# EAGLE board ALU (EAGLE 9.4.2)
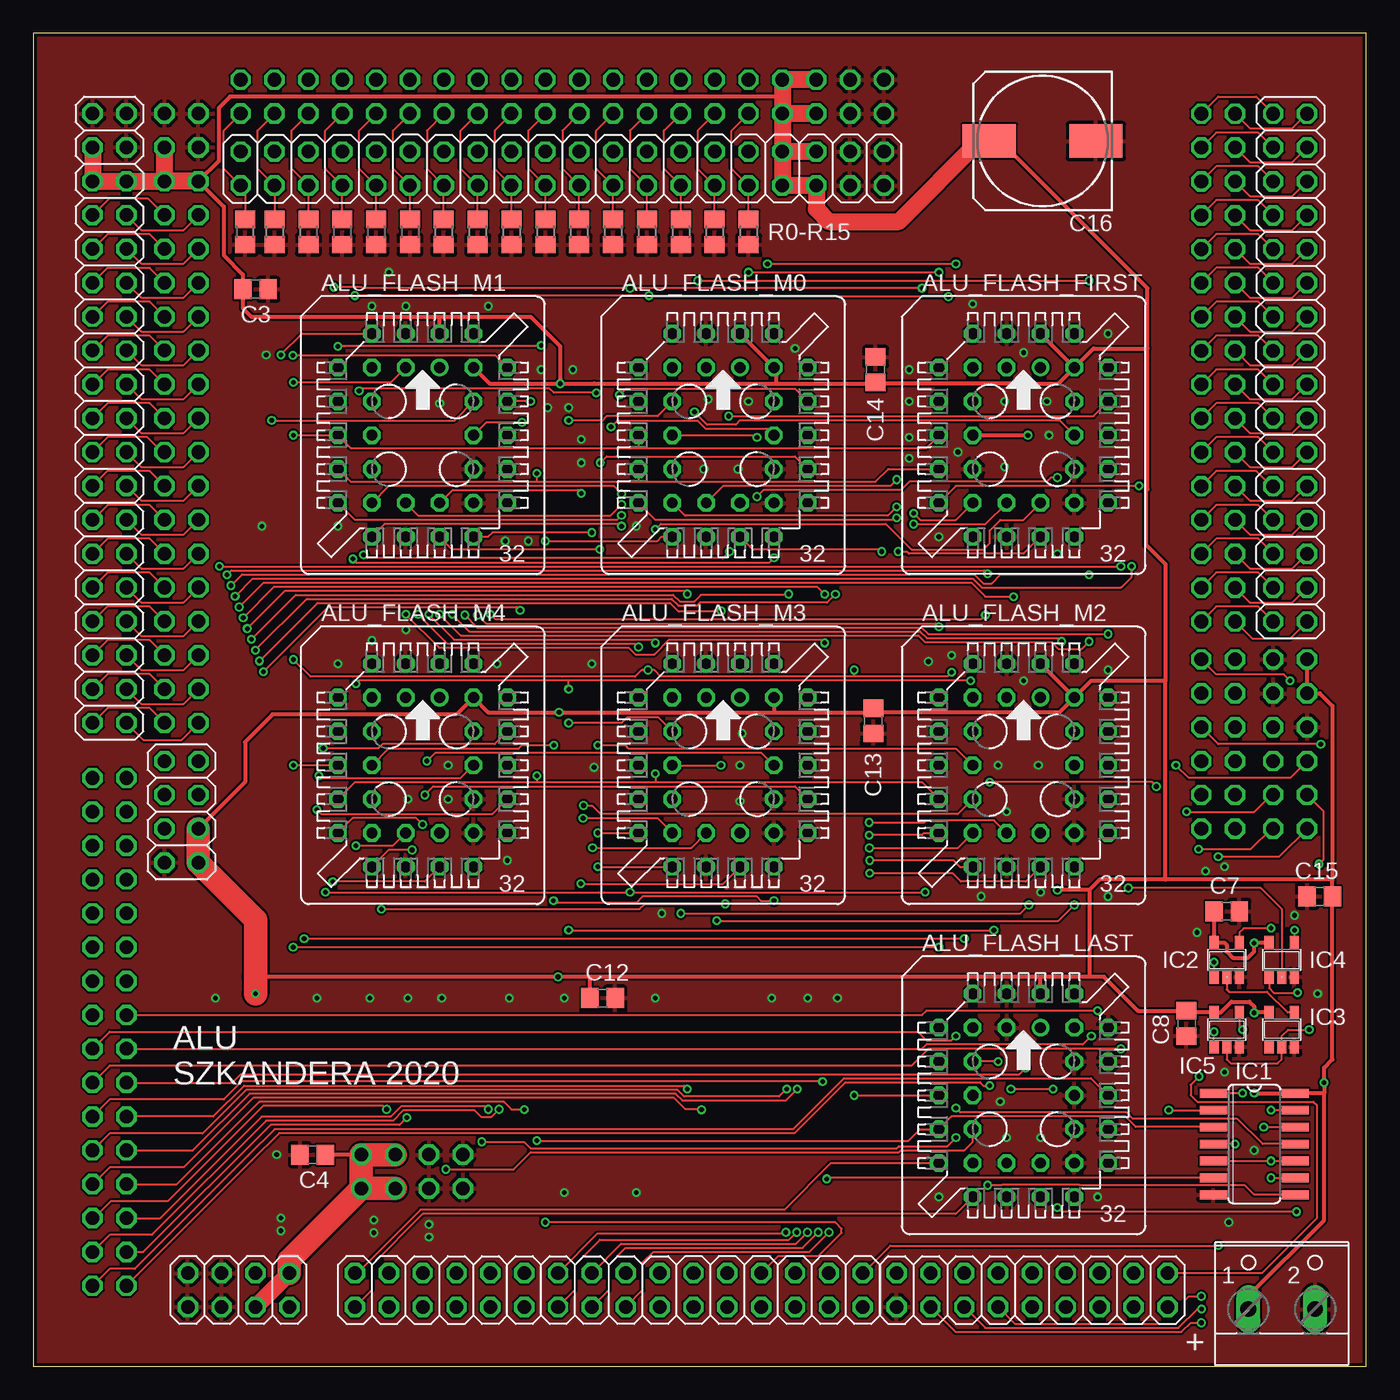
[diagram p2: board, top side]
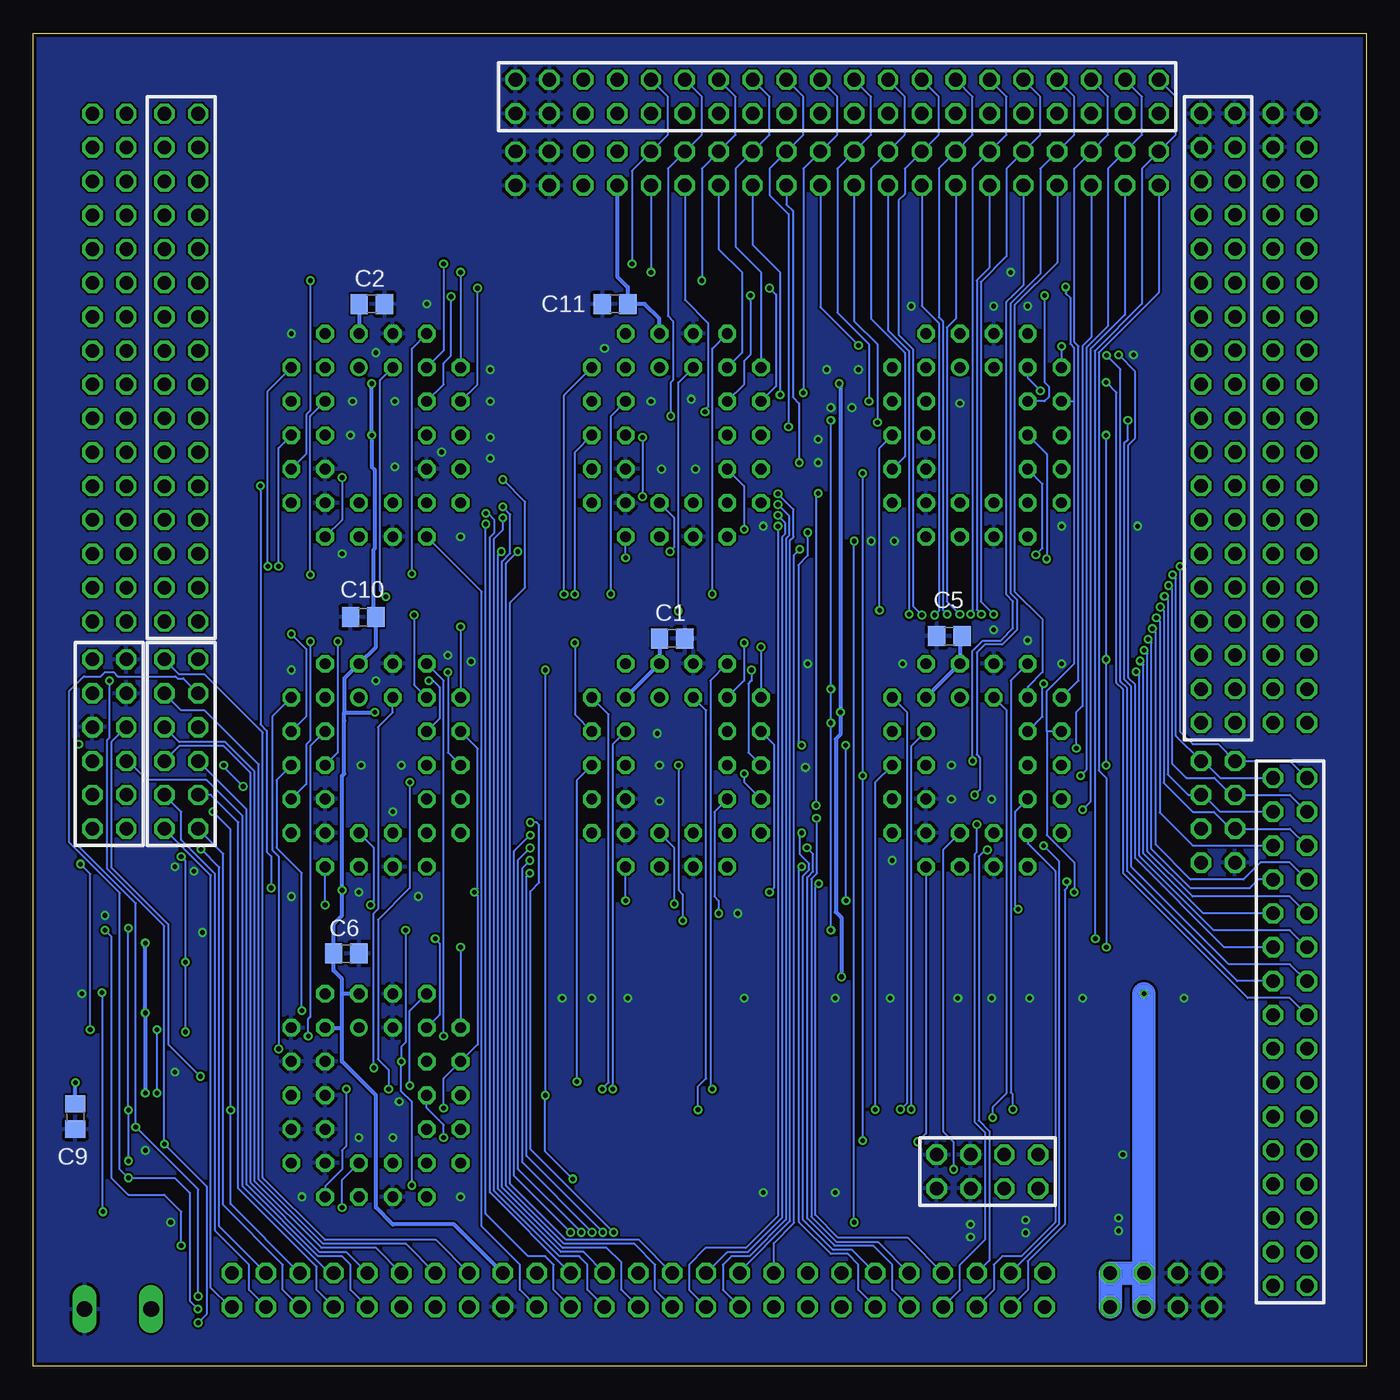
[diagram p3: board, bottom side, seen from below]

Size 100 x 100 mm. Coordinates in mm from the lower left corner, seen from the top.
Outline: 0,0 100,0 100,100 0,100 0,0
Copper layers (1*16): Top 0.035mm / dielectric 1.5mm / Bottom 0.035mm
Design rules "SeeedStudio_2layer_DRU_no_angle_20140221": minimum track width 6mil, minimum drill 12mil, track to track 6mil, track to pad 6mil, pad to pad 6mil, via to via 6mil, smd to smd 0mil, copper to edge 10mil, drill to drill 10mil, minimum pad ring 10mil, minimum via ring 6mil, stop-mask expansion 2mil, vias tented up to drill 100mil, thermal gap 10mil

## Footprints (pad centres in the part's own frame; a part is rotated, then mirrored left to right if it is on the bottom)
S32 = drill 0.813: 1 1.27,5.08 | drill 0.813 octagon: 2 -1.27,7.62; 3 -1.27,5.08; 4 -3.81,7.62; 5 -6.35,5.08; 6 -3.81,5.08; 7 -6.35,2.54; 8 -3.81,2.54; 9 -6.35,0; 10 -3.81,0; 11 -6.35,-2.54; 12 -3.81,-2.54; 13 -6.35,-5.08; 14 -3.81,-7.62; 15 -3.81,-5.08; 16 -1.27,-7.62; 17 -1.27,-5.08; 18 1.27,-7.62; 19 1.27,-5.08; 20 3.81,-7.62; 21 6.35,-5.08; 22 3.81,-5.08; 23 6.35,-2.54; 24 3.81,-2.54; 25 6.35,0; 26 3.81,0; 27 6.35,2.54; 28 3.81,2.54; 29 6.35,5.08; 30 3.81,7.62; 31 3.81,5.08; 32 1.27,7.62
2X16 = drill 1.016 octagon: 1 -19.05,-1.27; 2 -19.05,1.27; 3 -16.51,-1.27; 4 -16.51,1.27; 5 -13.97,-1.27; 6 -13.97,1.27; 7 -11.43,-1.27; 8 -11.43,1.27; 9 -8.89,-1.27; 10 -8.89,1.27; 11 -6.35,-1.27; 12 -6.35,1.27; 13 -3.81,-1.27; 14 -3.81,1.27; 15 -1.27,-1.27; 16 -1.27,1.27; 17 1.27,-1.27; 18 1.27,1.27; 19 3.81,-1.27; 20 3.81,1.27; 21 6.35,-1.27; 22 6.35,1.27; 23 8.89,-1.27; 24 8.89,1.27; 25 11.43,-1.27; 26 11.43,1.27; 27 13.97,-1.27; 28 13.97,1.27; 29 16.51,-1.27; 30 16.51,1.27; 31 19.05,-1.27; 32 19.05,1.27
2X04 = drill 1.016 octagon: 1 -3.81,-1.27; 2 -3.81,1.27; 3 -1.27,-1.27; 4 -1.27,1.27; 5 1.27,-1.27; 6 1.27,1.27; 7 3.81,-1.27; 8 3.81,1.27
C0805 = smd 1.3 x 1.5: 1 -0.95,0; 2 0.95,0
153CLV-1010 = smd 4 x 2.5: + 4,0; - -4,0
SO14 = smd 0.66 x 2.032: 1 -3.81,-3.073; 2 -2.54,-3.073; 3 -1.27,-3.073; 4 0,-3.073; 5 1.27,-3.073; 6 2.54,-3.073; 7 3.81,-3.073; 8 3.81,3.073; 9 2.54,3.073; 10 1.27,3.073; 11 0,3.073; 12 -1.27,3.073; 13 -2.54,3.073; 14 -3.81,3.073
SOT23-5 = smd 0.69 x 0.99: 1 -0.95,-1.29; 2 0,-1.29; 3 0.95,-1.29; 4 0.95,1.3; 5 -0.95,1.3
2X09 = drill 1.016 octagon: 1 -10.16,-1.27; 2 -10.16,1.27; 3 -7.62,-1.27; 4 -7.62,1.27; 5 -5.08,-1.27; 6 -5.08,1.27; 7 -2.54,-1.27; 8 -2.54,1.27; 9 0,-1.27; 10 0,1.27; 11 2.54,-1.27; 12 2.54,1.27; 13 5.08,-1.27; 14 5.08,1.27; 15 7.62,-1.27; 16 7.62,1.27; 17 10.16,-1.27; 18 10.16,1.27
2X06 = drill 1.016 octagon: 1 -6.35,-1.27; 2 -6.35,1.27; 3 -3.81,-1.27; 4 -3.81,1.27; 5 -1.27,-1.27; 6 -1.27,1.27; 7 1.27,-1.27; 8 1.27,1.27; 9 3.81,-1.27; 10 3.81,1.27; 11 6.35,-1.27; 12 6.35,1.27
R0805 = smd 1.3 x 1.5: 1 -0.95,0; 2 0.95,0
2X20 = drill 1.016 octagon: 1 -24.13,-1.27; 2 -24.13,1.27; 3 -21.59,-1.27; 4 -21.59,1.27; 5 -19.05,-1.27; 6 -19.05,1.27; 7 -16.51,-1.27; 8 -16.51,1.27; 9 -13.97,-1.27; 10 -13.97,1.27; 11 -11.43,-1.27; 12 -11.43,1.27; 13 -8.89,-1.27; 14 -8.89,1.27; 15 -6.35,-1.27; 16 -6.35,1.27; 17 -3.81,-1.27; 18 -3.81,1.27; 19 -1.27,-1.27; 20 -1.27,1.27; 21 1.27,-1.27; 22 1.27,1.27; 23 3.81,-1.27; 24 3.81,1.27; 25 6.35,-1.27; 26 6.35,1.27; 27 8.89,-1.27; 28 8.89,1.27; 29 11.43,-1.27; 30 11.43,1.27; 31 13.97,-1.27; 32 13.97,1.27; 33 16.51,-1.27; 34 16.51,1.27; 35 19.05,-1.27; 36 19.05,1.27; 37 21.59,-1.27; 38 21.59,1.27; 39 24.13,-1.27; 40 24.13,1.27
2X19 = drill 1.016 octagon: 1 -22.86,-1.27; 2 -22.86,1.27; 3 -20.32,-1.27; 4 -20.32,1.27; 5 -17.78,-1.27; 6 -17.78,1.27; 7 -15.24,-1.27; 8 -15.24,1.27; 9 -12.7,-1.27; 10 -12.7,1.27; 11 -10.16,-1.27; 12 -10.16,1.27; 13 -7.62,-1.27; 14 -7.62,1.27; 15 -5.08,-1.27; 16 -5.08,1.27; 17 -2.54,-1.27; 18 -2.54,1.27; 19 0,-1.27; 20 0,1.27; 21 2.54,-1.27; 22 2.54,1.27; 23 5.08,-1.27; 24 5.08,1.27; 25 7.62,-1.27; 26 7.62,1.27; 27 10.16,-1.27; 28 10.16,1.27; 29 12.7,-1.27; 30 12.7,1.27; 31 15.24,-1.27; 32 15.24,1.27; 33 17.78,-1.27; 34 17.78,1.27; 35 20.32,-1.27; 36 20.32,1.27; 37 22.86,-1.27; 38 22.86,1.27
W237-102 = drill 1.194 long: 1 -2.5,-1.27; 2 2.5,-1.27

## Placement (x,y rotation side)
ALU_FLASH_FIRST  [S32]  74.3,69.85 0 top
ALU_FLASH_LAST  [S32]  74.3,20.32 0 top
ALU_FLASH_M0  [S32]  51.75,69.85 0 top
ALU_FLASH_M1  [S32]  29.21,69.85 0 top
ALU_FLASH_M2  [S32]  74.3,45.09 0 top
ALU_FLASH_M3  [S32]  51.75,45.09 0 top
ALU_FLASH_M4  [S32]  29.21,45.09 0 top
ALU_O_C0  [2X16]  43.18,5.71 180 top
ALU_Y_C0  [2X16]  5.71,25.08 270 top
ALU_Y_C1  [2X04]  11.11,41.59 270 top
C1  [C0805]  52.07,54.61 0 bottom
C2  [C0805]  74.61,79.69 0 bottom
C3  [C0805]  16.67,80.8 0 top
C4  [C0805]  20.95,15.88 180 top
C5  [C0805]  31.27,54.77 180 bottom
C6  [C0805]  76.52,30.96 0 bottom
C7  [C0805]  89.53,34.13 0 top
C8  [C0805]  86.52,25.72 270 top
C9  [C0805]  96.84,18.73 270 bottom
C10  [C0805]  75.25,56.2 180 bottom
C11  [C0805]  56.36,79.69 180 bottom
C12  1u  [C0805]  42.7,27.62 0 top
C13  1u  [C0805]  63.02,48.42 270 top
C14  1u  [C0805]  63.18,74.77 90 top
C15  1u  [C0805]  96.52,35.24 180 top
C16  [153CLV-1010]  75.72,91.92 180 top
IC1  74AC08D  [SO14]  91.6,16.67 270 top
IC2  74AHC1G00DBV  [SOT23-5]  89.53,30.48 0 top
IC3  74AHC1G04DBV  [SOT23-5]  93.66,25.24 0 top
IC4  74AHC1G32DBV  [SOT23-5]  93.66,30.48 0 top
IC5  74AHC1G02DBV  [SOT23-5]  89.53,25.24 0 top
JP2  [2X09]  74.93,5.71 0 top
JP3  [2X06]  88.9,46.67 270 top
JP4  [2X06]  94.3,46.67 270 top
PWR  [2X04]  15.4,5.71 180 top
PWR1  [2X04]  28.42,14.61 0 top
R0  [R0805]  53.66,85.09 270 top
R1  [R0805]  51.12,85.09 270 top
R2  [R0805]  48.58,85.09 270 top
R3  [R0805]  46.04,85.09 270 top
R4  [R0805]  43.5,85.09 270 top
R5  [R0805]  40.96,85.09 270 top
R6  [R0805]  38.42,85.09 270 top
R7  [R0805]  35.88,85.09 270 top
R8  [R0805]  33.34,85.09 270 top
R9  [R0805]  30.8,85.09 270 top
R10  [R0805]  28.26,85.09 270 top
R11  [R0805]  25.72,85.09 270 top
R12  [R0805]  23.18,85.09 270 top
R13  [R0805]  20.64,85.09 270 top
R14  [R0805]  18.1,85.09 270 top
R15  [R0805]  15.88,85.09 270 top
RB0_C0  [2X20]  39.69,89.85 180 top
RB0_C1  [2X20]  39.69,95.25 180 top
RB1_C0  [2X19]  5.71,71.12 270 top
RB1_C1  [2X19]  11.11,71.12 270 top
RTB_C0  [2X16]  94.3,74.92 270 top
RTB_C1  [2X16]  88.9,74.92 270 top
X1  [W237-102]  93.66,5.56 0 top

## Tracks (layer width: path | path; a pad name or v marks a point on that pad's centre or on a via)
#ALU_G
  Bottom 0.152: JP2.9 76.2,5.71 76.2,7.62 76.83,8.26 78.63,8.26 84,13.63 84,41.78 JP3.7
#REG_RTB_G
  Bottom 0.152: JP2.10 76.5,8.56 78.5,8.56 83.7,13.76 83.7,44.49 85.72,46.51 89.06,46.51 JP3.8
ALU_I  (via drill 0.35)
  Top 0.152: ALU_FLASH_M1.11 23.81,66.36 37.78,66.36 | ALU_FLASH_FIRST.11 64.14,67.31 63.19,66.36 45.4,66.36 | 37.78,66.36 38.58,66.36 45.4,66.36 | ALU_FLASH_M0.11 45.4,66.36 | ALU_FLASH_M4.11 24.13,43.81 37.78,43.81 | ALU_FLASH_M2.11 66.67,43.81 46.67,43.81 | 37.78,43.81 38.58,43.81 46.67,43.81 | v46.67,44.45 46.67,43.81 | 37.78,66.36 v37.78,66.99 | v37.78,44.29 37.78,43.81 | v37.78,16.92 65.66,16.92 66.52,17.78 ALU_FLASH_LAST.11 68.9,18.73 81.92,18.73 82.71,17.94 IC1.3
  Bottom 0.152: v37.78,66.99 v37.78,44.29 v37.78,16.92 | v46.67,44.45 46.67,43.81 ALU_FLASH_M3.11
ALU_O_0  (via drill 0.35)
  Top 0.152: ALU_O_C0.1 64.29,9.05 v88.9,9.05 | v94.61,32.7 IC4.4
  Bottom 0.152: v88.9,9.05 88.9,11.59 90.17,12.86 92.87,12.86 94.14,14.13 94.14,32.23 v94.61,32.7
ALU_O_1
  Bottom 0.152: ALU_O_C0.2 63.5,5.71 63.5,7.62 66.36,10.48 66.36,58.1 ALU_FLASH_FIRST.14
ALU_O_2  (via drill 0.35)
  Top 0.152: v66.04,63.99 66.54,63.49 69.2,63.49 ALU_FLASH_FIRST.15
  Bottom 0.152: ALU_O_C0.3 65.75,13.04 65.75,62.2 65.41,62.55 65.41,63.5 65.89,63.99 v66.04,63.99
ALU_O_3  (via drill 0.35)
  Top 0.152: v66.04,63.18 71.44,63.18 ALU_FLASH_FIRST.17
  Bottom 0.152: ALU_O_C0.4 60.96,5.71 60.96,7.62 61.59,8.26 62.87,8.26 66.05,11.44 66.05,63.17 v66.04,63.18
ALU_O_4  (via drill 0.35)
  Top 0.152: v64.89,61.12 65.52,61.12 65.68,60.96 74.3,60.96 ALU_FLASH_FIRST.18
  Bottom 0.152: ALU_O_C0.5 58.74,8.57 60.41,8.57 65.14,13.29 65.14,60.87 v64.89,61.12
ALU_O_5  (via drill 0.35)
  Top 0.152: v64.77,63.66 64.61,63.5 46.67,63.5 ALU_FLASH_M0.13
  Bottom 0.152: ALU_O_C0.6 58.42,5.71 58.42,7.62 59.05,8.26 60.53,8.26 65.44,13.17 65.44,62.08 64.77,62.75 v64.77,63.66
ALU_O_6  (via drill 0.35)
  Top 0.152: ALU_O_C0.7 55.89,8.27 58.91,8.27 60.64,10 60.64,10.32 60.17,10.79 v38.42,10.79 | v38.42,61.91 46.83,61.91 47.15,62.23 ALU_FLASH_M0.14
  Bottom 0.152: v38.42,10.79 v38.42,61.91
ALU_O_7  (via drill 0.35)
  Top 0.152: v64.77,64.47 64.11,63.8 48.91,63.8 ALU_FLASH_M0.15
  Bottom 0.152: ALU_O_C0.8 55.88,5.71 55.88,7.78 56.98,8.88 60.29,8.88 64.83,13.42 64.83,60.39 64.21,61.01 64.21,63.91 v64.77,64.47
ALU_O_8  (via drill 0.35)
  Top 0.152: v64.77,66.52 64.29,66.04 64.14,66.04 51.75,66.04 ALU_FLASH_M0.17
  Bottom 0.152: ALU_O_C0.9 54.57,9.49 60.04,9.49 64.22,13.67 64.22,57.31 63.1,58.43 63.1,64.85 v64.77,66.52
ALU_O_9  (via drill 0.35)
  Top 0.152: v63.66,61.12 63.5,61.28 53.98,61.28 ALU_FLASH_M0.18
  Bottom 0.152: ALU_O_C0.10 53.34,5.71 53.34,7.62 54.9,9.18 60.16,9.18 64.53,13.55 64.53,60.25 v63.66,61.12
ALU_O_10  (via drill 0.35)
  Top 0.152: v44.13,63.83 43.79,63.49 24.14,63.49 ALU_FLASH_M1.13
  Bottom 0.152: v44.13,63.83 43.58,63.27 43.58,62.48 43.83,62.23 43.83,11.14 46.41,8.56 47.95,8.56 ALU_O_C0.11
ALU_O_11  (via drill 0.35)
  Top 0.152: v44.13,63.02 43.97,63.18 26.35,63.18 ALU_FLASH_M1.14
  Bottom 0.152: v44.13,63.02 44.13,11.27 46.54,8.87 49.55,8.87 50.8,7.62 50.8,5.71 ALU_O_C0.12
ALU_O_12  (via drill 0.35)
  Top 0.152: v44.13,65.44 43.52,66.05 26.68,66.05 ALU_FLASH_M1.15
  Bottom 0.152: ALU_O_C0.13 46.99,7.12 43.22,10.89 43.22,61.97 42.97,62.22 42.97,64.28 v44.13,65.44
ALU_O_13  (via drill 0.35)
  Top 0.152: v44.13,64.64 43.29,63.79 28.92,63.79 ALU_FLASH_M1.17
  Bottom 0.152: v44.13,64.64 43.27,63.78 43.27,62.35 43.52,62.1 43.52,11.02 46.29,8.26 47.62,8.26 48.26,7.62 48.26,5.71 ALU_O_C0.14
ALU_O_14  (via drill 0.35)
  Top 0.152: ALU_FLASH_M1.18 31.43,61.28 v42.5,61.28
  Bottom 0.152: ALU_O_C0.15 44.45,9.23 42.91,10.77 42.91,60.87 v42.5,61.28
ALU_O_15  (via drill 0.35)
  Top 0.152: ALU_O_C0.16 45.72,5.71 45.72,7.78 46.51,8.57 58.22,8.57 v59.69,10.04 | ALU_FLASH_M2.13 66.83,40.01 66.67,39.85 v62.72,39.85
  Bottom 0.152: v59.69,10.04 63.92,14.27 63.92,38.64 v62.72,39.85
ALU_O_16  (via drill 0.35)
  Top 0.152: ALU_O_C0.17 44.11,9.18 57.22,9.18 v58.08,10.04 | ALU_FLASH_M2.14 69.53,37.47 69.06,37.94 v62.74,37.94
  Bottom 0.152: v58.08,10.04 63.31,15.28 63.31,37.37 v62.74,37.94
ALU_O_17  (via drill 0.35)
  Top 0.152: ALU_O_C0.18 43.18,5.71 43.18,7.62 44.44,8.88 57.72,8.88 v58.88,10.04 | v62.73,38.88 69.36,38.88 ALU_FLASH_M2.15
  Bottom 0.152: v58.88,10.04 63.61,14.77 63.61,37.99 v62.73,38.88
ALU_O_18  (via drill 0.35)
  Top 0.152: ALU_O_C0.19 42.34,9.95 56.37,9.95 v56.46,10.04 | v62.72,40.8 66.84,40.8 67,40.96 72.07,40.96 ALU_FLASH_M2.17
  Bottom 0.152: v56.46,10.04 62.7,16.28 62.7,35.62 62.04,36.28 62.04,40.6 62.24,40.8 v62.72,40.8
ALU_O_19  (via drill 0.35)
  Top 0.152: ALU_O_C0.20 40.64,5.71 40.64,7.62 42.51,9.49 56.71,9.49 v57.27,10.04 | v62.75,36.99 68.94,36.99 69.58,36.35 74.45,36.35 ALU_FLASH_M2.18
  Bottom 0.152: v57.27,10.04 63.01,15.78 63.01,36.74 v62.75,36.99
ALU_O_20  (via drill 0.35)
  Top 0.152: v42.36,40.01 ALU_FLASH_M3.13
  Bottom 0.152: v42.36,40.01 42.52,39.85 42.52,38.42 41.8,37.7 41.8,37.23 42.24,36.8 42.24,10.97 39.99,8.72 38.56,8.72 ALU_O_C0.21
ALU_O_21  (via drill 0.35)
  Top 0.152: v42.36,37.47 ALU_FLASH_M3.14
  Bottom 0.152: v42.36,37.47 42.55,37.28 42.55,10.79 40.16,8.41 38.89,8.41 38.1,7.62 38.1,5.71 ALU_O_C0.22
ALU_O_22  (via drill 0.35)
  Top 0.152: v41.25,41.12 46.83,41.12 ALU_FLASH_M3.15
  Bottom 0.152: v41.25,41.12 41.19,41.06 41.19,36.98 41.63,36.54 41.63,11.22 39.74,9.33 36.63,9.33 ALU_O_C0.23
ALU_O_23  (via drill 0.35)
  Top 0.152: v41.96,38.89 49.37,38.89 ALU_FLASH_M3.17
  Bottom 0.152: ALU_O_C0.24 35.56,5.71 35.56,7.62 36.96,9.02 39.87,9.02 41.94,11.09 41.94,36.67 41.5,37.11 41.5,38.43 v41.96,38.89
ALU_O_24  (via drill 0.35)
  Top 0.152: v41.08,36.2 51.75,36.2 ALU_FLASH_M3.18
  Bottom 0.152: v41.08,36.2 41.33,35.94 41.33,11.35 39.61,9.63 34.4,9.63 ALU_O_C0.25
ALU_O_25  (via drill 0.35)
  Top 0.152: v29.21,40.64 28.73,41.12 23.97,41.12 ALU_FLASH_M4.13
  Bottom 0.152: ALU_O_C0.26 30.48,5.71 30.48,7.62 28.57,9.53 28.57,17.51 29.37,18.3 29.37,38.42 29.21,38.58 v29.21,40.64
ALU_O_26  (via drill 0.35)
  Top 0.152: v28.42,38.73 26.67,38.73 ALU_FLASH_M4.14
  Bottom 0.152: v28.42,38.73 28.57,38.73 29.06,38.25 29.06,18.43 28.26,17.62 28.26,7.94 ALU_O_C0.27
ALU_O_27
  Bottom 0.152: ALU_O_C0.28 27.94,5.71 27.94,7.62 27.3,8.26 25.88,8.26 23.34,10.79 23.34,37.15 25.4,39.21 ALU_FLASH_M4.15
ALU_O_28  (via drill 0.35)
  Top 0.152: v24.21,39.05 v24.21,39.04 26.98,39.04 ALU_FLASH_M4.17
  Bottom 0.152: ALU_O_C0.29 26.67,7.03 23.03,10.67 23.03,37.88 v24.21,39.05
ALU_O_29  (via drill 0.35)
  Top 0.152: ALU_FLASH_M4.18 29.37,36.35 v22.46,36.35
  Bottom 0.152: ALU_O_C0.30 25.4,5.71 25.4,7.87 22.62,10.65 22.62,35.72 22.46,35.88 v22.46,36.35
ALU_O_30
  Top 0.152: ALU_O_C0.31 24.29,6.99 29.05,11.75 56.36,11.75 59.85,15.24 ALU_FLASH_LAST.13
ALU_O_31
  Top 0.152: ALU_O_C0.32 25.4,5.71 25.4,7.62 29.21,11.43 69.22,11.43 ALU_FLASH_LAST.14
ALU_OP_0  (via drill 0.35)
  Top 0.152: IC5.1 v88.58,25.08 | v88.58,30.32 IC2.1 | v88.9,38.23 93.48,38.23 JP4.12
  Bottom 0.152: v88.58,25.08 v88.58,30.32 88.58,37.91 v88.9,38.23
ALU_OP_1  (via drill 0.35)
  Top 0.152: IC5.2 89.53,23.02 89.85,22.7 93.34,22.7 93.66,23.02 IC3.2 93.66,24.77 94.14,25.24 v95.73,25.24 | v96.47,37.67 96.79,37.99 96.79,41.64 JP4.10
  Bottom 0.152: v95.73,25.24 95.73,36.93 v96.47,37.67
ALU_Y_0  (via drill 0.35)
  Top 0.152: v13.97,60.01 v81.6,60.01
  Bottom 0.152: v81.6,60.01 81.6,68.9 ALU_FLASH_FIRST.25 | v13.97,60.01 13.97,47.62 13.02,46.67 11.11,46.67 ALU_Y_C1.1 5.71,45.4 ALU_Y_C0.1
ALU_Y_1  (via drill 0.35)
  Top 0.152: v14.53,59.37 14.86,59.7 71.34,59.7 v71.6,59.45
  Bottom 0.152: v14.53,59.37 14.28,59.12 14.28,47.3 ALU_Y_C1.2 12.22,45.4 10.95,44.13 ALU_Y_C0.2 | v71.6,59.45 71.6,76.36 ALU_FLASH_FIRST.4
ALU_Y_2  (via drill 0.35)
  Top 0.152: v14.83,58.56 15.66,59.4 70.62,59.4 71.28,58.74 71.91,58.74 72.56,59.38 79.2,59.38 v79.22,59.37
  Bottom 0.152: v14.83,58.56 14.58,58.31 14.58,45.22 13.49,44.13 11.38,44.13 10.12,42.86 ALU_Y_C1.3 5.71,42.86 ALU_Y_C0.3 | v79.22,59.37 79.22,71.28 ALU_FLASH_FIRST.28
ALU_Y_3  (via drill 0.35)
  Top 0.152: v15.14,57.76 16.47,59.09 70.49,59.09 71.15,58.43 81.62,58.43 82.41,59.21 v82.41,60.01
  Bottom 0.152: v15.14,57.76 14.88,57.51 14.88,44.41 13.34,42.86 ALU_Y_C1.4 12.22,42.86 10.95,41.59 ALU_Y_C0.4 | v82.41,60.01 82.41,73.17 ALU_FLASH_FIRST.29
ALU_Y_4  (via drill 0.35)
  Top 0.152: v15.44,56.95 17.28,58.79 70.37,58.79 71.42,57.73 v73.55,57.73
  Bottom 0.152: v15.44,56.95 15.19,56.7 15.19,43.76 13.02,41.59 11.43,41.59 10.16,40.32 ALU_Y_C1.5 5.71,40.32 ALU_Y_C0.5 | v73.55,57.73 73.98,58.16 73.98,73.98 ALU_FLASH_FIRST.3
ALU_Y_5  (via drill 0.35)
  Top 0.152: v15.74,56.14 18.09,58.48 58.8,58.48 v59.37,57.91
  Bottom 0.152: v15.74,56.14 15.49,55.89 15.49,41.53 13.02,39.05 ALU_Y_C0.6 | v59.37,57.91 59.37,68.58 ALU_FLASH_M0.25
ALU_Y_6  (via drill 0.35)
  Top 0.152: v16.05,55.34 18.89,58.18 48.8,58.18 v49.05,57.93
  Bottom 0.152: ALU_Y_C0.7 5.71,37.78 7.94,37.78 9.21,36.51 13.18,36.51 15.8,39.13 15.8,55.09 v16.05,55.34 | v49.05,57.93 49.05,76.36 ALU_FLASH_M0.4
ALU_Y_7  (via drill 0.35)
  Top 0.152: v16.36,54.53 19.7,57.87 48.01,57.87 48.52,57.37 49.59,57.37 50.08,57.86 56.61,57.86 v56.67,57.93
  Bottom 0.152: ALU_Y_C0.8 8.1,36.51 8.73,35.88 13.18,35.88 16.1,38.8 16.1,54.28 v16.36,54.53 | v56.67,57.93 56.67,71.28 ALU_FLASH_M0.28
ALU_Y_8  (via drill 0.35)
  Top 0.152: v16.66,53.72 20.51,57.57 47.89,57.57 48.39,57.07 49.81,57.07 50.02,57.28 59.55,57.28 v60.18,57.91
  Bottom 0.152: ALU_Y_C0.9 5.71,35.24 13.02,35.24 16.41,38.63 16.41,53.47 v16.66,53.72 | v60.18,57.91 60.18,72.85 ALU_FLASH_M0.29
ALU_Y_9  (via drill 0.35)
  Top 0.152: v16.96,52.91 21.31,57.26 47.76,57.26 48.42,56.6 51.56,56.6 v51.61,56.66
  Bottom 0.152: ALU_Y_C0.10 12.22,33.97 16.71,38.46 16.71,52.66 v16.96,52.91 | v51.61,56.66 51.61,73.8 ALU_FLASH_M0.3
ALU_Y_10  (via drill 0.35)
  Top 0.152: v17.27,52.11 22.12,56.96 36.26,56.96 v36.51,56.71
  Bottom 0.152: ALU_Y_C0.11 5.71,32.7 11.43,32.7 17.02,38.29 17.02,51.86 v17.27,52.11 | v36.51,56.71 36.51,68.9 ALU_FLASH_M1.25
ALU_Y_11  (via drill 0.35)
  Top 0.152: v18.57,75.88 20.16,77.47 ALU_FLASH_M1.4
  Bottom 0.152: ALU_Y_C0.12 10.64,31.43 17.32,38.12 17.32,51.14 17.82,51.64 17.82,69.12 17.32,69.62 17.32,74.63 v18.57,75.88
ALU_Y_12  (via drill 0.35)
  Top 0.152: ALU_FLASH_M1.28 31.59,70.96 v17.88,70.96
  Bottom 0.152: ALU_Y_C0.13 5.71,30.16 10.32,30.16 17.63,37.47 17.63,51.01 18.13,51.51 18.13,69.28 17.88,69.53 v17.88,70.96
ALU_Y_13  (via drill 0.35)
  Top 0.152: ALU_FLASH_M1.29 34.65,75.84 v19.48,75.84
  Bottom 0.152: ALU_Y_C0.14 9.68,28.89 17.93,37.14 17.93,50.88 18.43,51.39 18.43,74.79 v19.48,75.84
ALU_Y_14  (via drill 0.35)
  Top 0.152: ALU_FLASH_M1.3 26.83,73.82 v19.51,73.82
  Bottom 0.152: ALU_Y_C0.15 5.71,27.62 8.89,27.62 18.24,36.97 18.24,50.76 18.74,51.26 18.74,73.05 v19.51,73.82
ALU_Y_15  (via drill 0.35)
  Top 0.152: ALU_Y_C0.16 66.67,26.35 66.99,26.67 78.9,26.67 v79.85,26.67
  Bottom 0.152: v79.85,26.67 79.85,36.99 81.76,38.89 81.76,43.97 ALU_FLASH_M2.25
ALU_Y_16  (via drill 0.35)
  Top 0.152: ALU_Y_C0.17 5.71,25.08 66.36,25.08 66.99,24.45 68.9,24.45 v69.22,24.77
  Bottom 0.152: v69.22,24.77 69.22,51.44 ALU_FLASH_M2.4
ALU_Y_17  (via drill 0.35)
  Top 0.152: v79.38,24.77 78.74,24.13 66.99,24.13 66.67,23.81 ALU_Y_C0.18
  Bottom 0.152: v79.38,24.77 79.38,26.04 79.22,26.19 79.22,46.51 ALU_FLASH_M2.28
ALU_Y_18  (via drill 0.35)
  Top 0.152: ALU_Y_C0.19 5.71,22.54 65.88,22.54 67.15,23.81 v81.6,23.81
  Bottom 0.152: v81.6,23.81 81.6,38.26 82.07,38.73 82.07,48.74 ALU_FLASH_M2.29
ALU_Y_19  (via drill 0.35)
  Top 0.152: ALU_Y_C0.20 14.92,21.27 15.56,21.91 73.98,21.91 v74.45,22.38
  Bottom 0.152: v74.45,22.38 74.45,33.97 74.14,34.29 74.14,47.94 73.03,49.05 ALU_FLASH_M2.3
ALU_Y_20  (via drill 0.35)
  Top 0.152: ALU_Y_C0.21 5.71,20 14.29,20 15.64,21.35 v59.21,21.35
  Bottom 0.152: v59.21,21.35 59.21,43.97 ALU_FLASH_M3.25
ALU_Y_21  (via drill 0.35)
  Top 0.152: v49.05,20.8 48.8,21.05 15.81,21.05 13.49,18.73 ALU_Y_C0.22
  Bottom 0.152: v49.05,20.8 49.21,20.95 49.21,51.44 ALU_FLASH_M3.4
ALU_Y_22  (via drill 0.35)
  Top 0.152: ALU_Y_C0.23 5.71,17.46 12.7,17.46 15.98,20.74 48.32,20.74 48.82,20.24 55.96,20.24 v56.52,20.8
  Bottom 0.152: v56.52,20.8 56.52,46.67 ALU_FLASH_M3.28
ALU_Y_23  (via drill 0.35)
  Top 0.152: v57.32,20.8 56.46,19.93 48.7,19.93 48.2,20.44 16.22,20.44 11.97,16.19 ALU_Y_C0.24
  Bottom 0.152: v57.32,20.8 56.83,21.29 56.83,48.9 ALU_FLASH_M3.29
ALU_Y_24  (via drill 0.35)
  Top 0.152: ALU_Y_C0.25 4.47,13.65 5.74,14.92 11.29,14.92 16.5,20.13 48.07,20.13 48.89,19.31 50.06,19.31 v50.13,19.24
  Bottom 0.152: v50.13,19.24 50.13,20.98 49.53,21.58 49.53,49.21 ALU_FLASH_M3.3
ALU_Y_25  (via drill 0.35)
  Top 0.152: v36.83,19.26 35.88,19.26 35.31,19.83 16.95,19.83 10.77,13.65 ALU_Y_C0.26
  Bottom 0.152: v36.83,19.26 36.83,43.81 ALU_FLASH_M4.25
ALU_Y_26  (via drill 0.35)
  Top 0.152: ALU_Y_C0.27 4.54,11.11 5.81,12.38 10.09,12.38 17.23,19.52 26.26,19.52 v26.51,19.27
  Bottom 0.152: v26.51,19.27 26.51,20.38 26.67,20.54 26.67,51.44 ALU_FLASH_M4.4
ALU_Y_27  (via drill 0.35)
  Top 0.152: v34.13,19.27 33.88,19.52 27.62,19.52 26.81,18.71 17.13,18.71 9.53,11.11 ALU_Y_C0.28
  Bottom 0.152: v34.13,19.27 34.13,46.51 ALU_FLASH_M4.28
ALU_Y_28  (via drill 0.35)
  Top 0.152: ALU_Y_C0.29 5.71,9.84 8.89,9.84 17.46,18.41 26.98,18.41 27.79,19.22 33.08,19.22 33.58,18.71 34.38,18.71 v34.94,19.27
  Bottom 0.152: v34.94,19.27 34.44,19.77 34.44,49.04 ALU_FLASH_M4.29
ALU_Y_29  (via drill 0.35)
  Top 0.152: v28.02,18.66 27.46,18.11 17.79,18.11 8.26,8.57 ALU_Y_C0.30
  Bottom 0.152: v28.02,18.66 28.02,19.45 26.98,20.49 26.98,49.2 ALU_FLASH_M4.3
ALU_Y_30
  Top 0.152: ALU_Y_C0.31 5.71,7.3 7.62,7.3 16.09,15.77 18.1,17.78 56.99,17.78 60.81,21.6 79.36,21.6 ALU_FLASH_LAST.25
ALU_Y_31  (via drill 0.35)
  Top 0.152: v71.75,21.05 71.28,21.05 71.03,21.3 60.94,21.3 57.12,17.48 18.43,17.48 16.4,15.44 ALU_Y_C0.32
  Bottom 0.152: v71.75,21.05 71.75,26.67 ALU_FLASH_LAST.4
B_0  (via drill 0.35)
  Top 0.152: ALU_FLASH_M0.10 54.13,69.85 v54.29,69.69 | v54.29,65.25 54.78,65.73 65.1,65.73 65.72,66.36 76.04,66.36 76.36,66.67 v76.83,66.67
  Bottom 0.152: v54.29,69.69 v54.29,65.25 | v76.83,66.67 76.83,63.5 ALU_FLASH_FIRST.20
B_1  (via drill 0.35)
  Top 0.152: v23.97,60.56 24.22,60.31 55.23,60.31 v55.56,60.64
  Bottom 0.152: ALU_FLASH_M1.10 23.97,68.42 v23.97,60.56 | v55.56,60.64 ALU_FLASH_M0.20
B_2  (via drill 0.35)
  Top 0.152: v42.36,46.59 44.42,46.59 44.67,46.34 69.23,46.34 ALU_FLASH_M2.10 | ALU_FLASH_M1.20 34.13,62.23 34.45,62.55 v41.91,62.55
  Bottom 0.152: v41.91,62.55 41.91,60.8 42.61,60.1 42.61,46.84 v42.36,46.59
B_3  (via drill 0.35)
  Top 0.152: ALU_FLASH_M3.10 v51.59,45.09 | v51.28,33.42 76.91,33.42 v78.11,34.61
  Bottom 0.152: v51.59,45.09 51.59,35.72 51.28,35.4 v51.28,33.42 | v78.11,34.61 ALU_FLASH_M2.20
B_4  (via drill 0.35)
  Top 0.152: ALU_FLASH_M4.10 26.66,46.34 36.42,46.34 36.67,46.59 v39.05,46.59 | v39.02,34.92 39.18,34.77 45.24,34.77 45.72,35.24 54.29,35.24 54.61,34.92 v55.56,34.92
  Bottom 0.152: v55.56,34.92 ALU_FLASH_M3.20 | v39.05,46.59 39.05,34.95 v39.02,34.92
B_5  (via drill 0.35)
  Top 0.152: v33.66,16.83 36.83,16.83 37.31,16.35 64.77,16.35 64.93,16.51 68.58,16.51 v69.22,17.14
  Bottom 0.152: ALU_FLASH_M4.20 33.02,17.46 v33.66,16.83 | v69.22,17.14 69.22,18.1 70.48,19.37 ALU_FLASH_LAST.10
BRANCH  (via drill 0.35)
  Top 0.152: JP4.8 94.3,44.13 86.68,44.13 v85.72,45.09 | v84.25,43.5 83.94,43.81 v71.75,43.81 | v73.34,20.8 v76.52,20.8
  Bottom 0.152: v85.72,45.09 85.72,44.97 v84.25,43.5 | v71.75,43.81 71.75,35.88 74.15,33.48 74.15,23.03 73.34,22.23 v73.34,20.8 | v76.52,20.8 76.52,16.51 76.83,16.19 76.83,14.76 78.11,13.49 ALU_FLASH_LAST.20
C_0  (via drill 0.35)
  Top 0.152: v46.67,62.78 47.08,63.2 63.95,63.2 65.88,61.27 65.88,61.28 65.89,61.27 71.27,61.27 71.75,61.75 71.75,62.71 72.55,63.5 74.3,63.5 ALU_FLASH_FIRST.19
  Bottom 0.152: ALU_FLASH_M0.12 46.67,66.04 v46.67,62.78
C_1  (via drill 0.35)
  Top 0.152: v52.23,61.12 51.73,60.62 25.03,60.62 v24.78,60.87
  Bottom 0.152: ALU_FLASH_M0.19 51.92,63.66 51.92,61.43 v52.23,61.12 | v24.78,60.87 24.28,61.37 24.28,66.19 ALU_FLASH_M1.12
C_2  (via drill 0.35)
  Top 0.152: ALU_FLASH_M1.19 31.46,65.75 40.87,65.75 v41.12,65.5 | v41.27,42.07 41.91,42.07 42.56,41.42 69.36,41.42 ALU_FLASH_M2.12
  Bottom 0.152: v41.12,65.5 41.27,65.34 v41.27,42.07
C_3  (via drill 0.35)
  Top 0.152: v48.58,33.97 74.06,33.97 v74.69,34.61
  Bottom 0.152: ALU_FLASH_M3.12 48.91,41.58 48.91,35.26 48.58,34.92 v48.58,33.97 | v74.69,34.61 74.44,34.86 74.44,38.88 ALU_FLASH_M2.19
C_4  (via drill 0.35)
  Top 0.152: v51.91,34.69 45.88,34.69 45.48,34.29 v26.11,34.29
  Bottom 0.152: ALU_FLASH_M4.12 26.35,41.59 26.35,34.53 v26.11,34.29 | v51.91,34.69 51.91,38.89 ALU_FLASH_M3.19
C_5  (via drill 0.35)
  Top 0.152: v30.96,14.76 36.04,14.76 37.32,16.05 64.94,16.05 65.1,16.2 69.86,16.2 70.48,16.83 ALU_FLASH_LAST.12
  Bottom 0.152: ALU_FLASH_M4.19 31.75,38.73 31.75,17.62 30.96,16.83 v30.96,14.76
CLK
  Bottom 0.152: JP2.8 74.27,8.87 78.37,8.87 83.39,13.88 83.39,44.61 85.6,46.82 89.05,46.82 JP3.6
F3G_0  (via drill 0.35)
  Top 0.152: ALU_FLASH_FIRST.9 66.99,68.9 45.4,68.9 | 45.4,68.9 23.81,68.9 ALU_FLASH_M1.9 v19.51,69.85 | ALU_FLASH_M0.9 45.4,68.9 | ALU_FLASH_M4.9 v19.51,45.09 | v68.9,52.07 68.58,51.75 61.59,51.75 | 61.59,51.75 61.28,51.75 47.07,51.75 46.59,52.23 v46.12,52.23 45.64,52.23 45.15,51.74 39.69,51.74 24.45,51.74 24.43,51.75 23.97,51.75 23.96,51.74 20.79,51.74 v19.51,53.02 | 61.59,51.75 v61.59,52.23 | v61.59,20.32 ALU_FLASH_LAST.9 | IC1.6 59.61,14.13 v59.53,14.05
  Bottom 0.152: v19.51,45.09 v19.51,53.02 19.51,69.6 19.51,69.67 v19.51,69.85 | ALU_FLASH_M3.9 46.35,46.04 46.35,51.2 46.12,51.44 v46.12,52.23 | ALU_FLASH_M2.9 68.9,46.04 v68.9,52.07 | v61.59,52.23 v61.59,20.32 61.59,16.11 v59.53,14.05
F3G_1  (via drill 0.35)
  Top 0.152: v24.2,51.2 24.44,51.44 40.16,51.44 | ALU_FLASH_M0.8 46.83,71.28 43.02,71.28 42.7,70.96 v40.16,70.96 | v40.16,32.7 v72.07,32.7 | v72.39,22.86 ALU_FLASH_LAST.8 | IC1.8 91.6,12.86 90.89,13.57 89.64,13.57 78.49,13.57 78.47,13.59 72.66,13.59 72.64,13.57 v71.6,13.57 | v68.66,80.25 46.27,80.25 v46.2,80.33 v24.13,80.33 | v70.33,51.44 40.16,51.44 | v40.16,50.8 40.16,51.44 | ALU_FLASH_M3.8 46.9,48.67 44.55,48.67 44.13,48.26 v40.16,48.26
  Bottom 0.152: ALU_FLASH_FIRST.8 69.22,73.66 69.22,75.25 68.66,75.8 v68.66,80.25 | v46.2,80.33 46.2,75.88 46.67,75.41 46.67,73.66 ALU_FLASH_M0.8 | v24.13,80.33 24.13,73.82 23.81,73.5 23.81,72.71 24.13,72.39 ALU_FLASH_M1.8 | ALU_FLASH_M4.8 24.29,48.74 24.29,51.11 v24.2,51.2 | v70.33,51.44 70.01,51.44 69.52,50.95 69.52,48.59 ALU_FLASH_M2.8 | v72.07,32.7 v72.06,32.69 72.06,24.3 72.39,23.97 v72.39,22.86 72.39,20.64 71.6,19.84 v71.6,13.57 | v40.16,32.7 v40.16,48.26 v40.16,50.8 v40.16,70.96
F3G_2  (via drill 0.35)
  Top 0.152: v66.67,80.88 46.51,80.88 v44.77,80.88 25.56,80.88 24.69,80.88 24.61,80.96 v22.54,80.96 | v21.91,35.56 v44.77,35.56 v66.91,35.56 | IC1.11 92.23,16.67 90.33,18.57 82.5,18.57 82.04,19.04 69.55,19.04 v69.22,19.37
  Bottom 0.152: ALU_FLASH_FIRST.7 66.67,73.66 v66.67,80.88 | v44.77,80.88 44.28,80.39 44.28,73.51 ALU_FLASH_M0.7 | 23.97,47.62 23.97,50.64 21.89,52.72 21.89,72.39 | ALU_FLASH_M4.7 23.97,47.62 | 23.97,47.62 23.97,39.85 23.18,39.05 21.91,37.78 v21.91,35.56 | ALU_FLASH_M2.7 66.66,46.34 66.66,35.81 v66.91,35.56 66.66,35.31 66.66,24.14 ALU_FLASH_LAST.7 69.22,21.59 v69.22,19.37 | ALU_FLASH_M3.7 44.44,46.66 44.44,35.89 v44.77,35.56 | v22.54,80.96 22.54,80.49 22.21,80.16 22.21,76.71 21.89,76.39 21.89,72.39 | ALU_FLASH_M1.7 21.89,72.39
GND  (via drill 0.35)
  other vias: 17.46,75.88 25.4,79.53 27.94,79.53 26.67,82.07 30.48,72.23 34.13,79.53 38.1,74.77 40.48,74.77 40.16,71.91 38.58,71.91 41.12,69.53 41.12,67.79 25.4,54.45 34.77,52.7 22.86,52.7 27.94,55.24 35.4,61.91 37.15,61.91 41.91,52.7 42.07,44.93 31.11,45.09 31.11,42.55 22.86,63.02 17.14,63.02 45.24,63.02 50.32,67.31 52.86,67.31 53.66,72.39 50.64,72.55 57.15,76.36 65.72,72.39 65.72,69.69 69.37,68.58 65.72,68.1 72.87,67.47 76.2,69.85 76.04,72.39 72.87,72.39 76.83,60.96 67.94,62.23 70.48,79.69 65.72,74.77 80.64,52.23 74.3,51.44 72.39,45.09 75.41,45.09 75.56,35.56 71.12,35.24 80.64,35.24 72.55,19.84 73.03,17.14 75.56,17.14 67.94,12.7 79.85,12.7 89.69,10.79 89.38,22.07 96.36,27.94 94.61,33.81 89.38,37.47 87.95,37.15 87.31,32.54 60.33,27.62 58.1,27.62 55.4,27.62 46.67,27.62 39.85,27.62 35.72,27.62 30.64,27.62 28.1,27.62 25.24,27.62 21.27,27.62 13.65,27.62 18.26,15.88 18.57,10.16 18.57,11.11 25.56,10.95 25.56,10 29.69,9.68 29.69,10.64 39.85,13.02 45.24,13.02 28.1,42.55 35.56,37.94 47.15,33.97 53.02,42.39 53.02,45.09 53.18,47.47 80.64,77.47 74.3,76.04 68.9,53.34 67.15,52.86 73.03,41.59 91.6,16.19
  pour Top: -10,109.06 117.47,109.06 117.47,24.77 117.47,-25.24 50.96,-25.24 -10,-25.24
  pour Bottom: -9.21,108.43 116.52,108.43 116.52,38.89 116.52,-20.32 44.77,-20.32 -9.21,-20.32
INS_F3_0  (via drill 0.35)
  Top 0.152: JP2.3 69.19,2.56 86.15,2.56 86.84,3.25 v87.63,3.25 | v90.17,16.67 IC1.4 | v94.3,51.44 93.82,51.91 88.74,51.91 JP3.1
  Bottom 0.152: v87.63,3.25 87,3.89 87,13.49 v90.17,16.67 90.17,33.02 94.46,37.31 94.46,46.99 94.3,47.15 v94.3,51.44
INS_F3_1  (via drill 0.35)
  Top 0.152: JP2.5 71.42,2.87 85.91,2.87 87.33,4.29 v87.64,4.29 | v92.87,14.13 IC1.9
  Bottom 0.152: v87.64,4.29 88.27,4.91 88.27,13.02 89.38,14.13 v92.87,14.13 93.5,14.76 93.5,35.49 97.31,39.3 97.31,50.64 96.2,51.75 94.93,51.75 94.61,52.07 93.98,52.07 93.66,51.75 89.33,51.75 89.19,51.61 88.74,51.61 87.63,50.49 JP3.3
INS_F3_2  (via drill 0.35)
  Top 0.152: JP2.7 73.66,3.17 85.72,3.17 86.36,3.81 86.36,4.92 86.68,5.24 v87.63,5.24 | v92.31,17.94 IC1.12 | v96.6,46.67 88.9,46.67 JP3.5
  Bottom 0.152: v87.63,5.24 87.63,13.26 v92.31,17.94 92.31,34.73 96.92,39.34 96.92,46.35 v96.6,46.67
INS_I  (via drill 0.35)
  Top 0.152: v85.19,19.21 IC1.2 | v86.52,41.59 91.6,41.59 92.87,42.86 JP4.9
  Bottom 0.152: JP2.14 85.19,12.17 v85.19,19.21 85.19,40.27 v86.52,41.59
LTCH_CLK
  Bottom 0.152: JP2.11 78.74,5.71 78.74,7.46 84.61,13.34 84.61,40.8 86.68,42.86 JP3.9
MEM_LOAD
  Bottom 0.152: JP2.6 72.03,9.17 78.25,9.17 83.09,14.01 83.09,45.15 87.15,49.21 88.9,49.21 JP3.4
MEM_STORE
  Bottom 0.152: JP2.4 69.8,9.47 78.12,9.47 82.78,14.14 82.78,47.54 87.15,51.91 89.06,51.91 JP3.2
N$1  (via drill 0.35)
  Top 0.152: v82.15,35.88 92.08,35.88 93.66,34.29 IC4.2 | ALU_FLASH_FIRST.13 69.22,66.04 v82.96,66.04
  Bottom 0.152: v82.96,66.04 82.96,48.15 82.48,47.67 82.48,38.59 82.15,38.26 v82.15,35.88
N$2  (via drill 0.35)
  Top 0.152: IC1.5 v92.87,15.4 IC1.10 | IC1.13 v92.87,19.21 | v92.87,32.86 90.81,32.86 90.48,32.54 IC2.4
  Bottom 0.152: v92.87,15.4 v92.87,19.21 v92.87,32.86
N$3
  Top 0.152: IC2.2 89.53,28.26 89.69,28.1 92.55,28.1 94.11,26.54 IC3.4
N$6  (via drill 0.35)
  Top 0.152: IC5.4 90.48,25.48 v90.73,25.24 | v90.73,20.48 IC1.1
  Bottom 0.152: v90.73,25.24 v90.73,20.48
PCE  (via drill 0.35)
  Top 0.152: v87.47,21.75 86.84,21.11 86.84,20.32 87.31,19.84 96.04,19.84 96.3,19.59 96.3,11.11 92.17,6.99 JP2.18
  Bottom 0.152: JP4.5 94.14,46.83 94.14,37.42 89.86,33.15 89.86,24.14 v87.47,21.75
RB0_0  (via drill 0.35)
  Top 0.152: v55.09,82.71 v69.22,82.71
  Bottom 0.152: v69.22,82.71 69.22,76.2 ALU_FLASH_FIRST.6 | v55.09,82.71 55.09,89.69 RB0_C0.9 52.39,92.39 52.39,95.25 RB0_C1.9
RB0_1  (via drill 0.35)
  Top 0.152: R0.1 RB0_C0.10 52.39,89.85 52.39,92.71 RB0_C1.10 | v53.66,82.07 v67.94,82.07
  Bottom 0.152: RB0_C0.10 v53.66,82.07 | v67.94,82.07 ALU_FLASH_FIRST.5
RB0_2  (via drill 0.35)
  Top 0.152: v52.17,71.28 79.53,71.28 ALU_FLASH_FIRST.27
  Bottom 0.152: v52.17,71.28 52.17,73.82 52.01,73.98 52.01,78.42 52.39,78.81 52.39,89.85 RB0_C0.11 49.85,92.39 49.85,95.25 RB0_C1.11
RB0_3  (via drill 0.35)
  Top 0.152: R1.1 RB0_C0.12 49.85,89.85 49.85,92.71 RB0_C1.12 | v49.61,71.6 50.56,70.64 52.7,70.64 53.03,70.97 76.98,70.97 ALU_FLASH_FIRST.26
  Bottom 0.152: RB0_C0.12 51.12,80.01 49.37,78.26 49.37,71.99 49.61,71.75 v49.61,71.6
RB0_4  (via drill 0.35)
  Top 0.152: v49.85,81.44 68.41,81.44 v79.22,81.44
  Bottom 0.152: v79.22,81.44 79.22,71.71 79.52,71.41 79.52,68.43 ALU_FLASH_FIRST.23 | v49.85,81.44 49.85,89.85 RB0_C0.13 47.31,92.39 47.31,95.25 RB0_C1.13
RB0_5
  Top 0.152: R2.1 RB0_C0.14 47.31,89.85 47.31,92.71 RB0_C1.14
  Bottom 0.152: RB0_C0.14 48.58,83.82 46.83,82.07 46.83,76.04 ALU_FLASH_M0.6
RB0_6
  Bottom 0.152: ALU_FLASH_M0.5 45.4,82.07 47.31,83.98 47.31,89.85 RB0_C0.15 44.77,92.39 44.77,95.25 RB0_C1.15
RB0_7  (via drill 0.35)
  Top 0.152: R3.1 RB0_C0.16 44.77,89.85 44.77,92.71 RB0_C1.16 | v43.97,72.87 44.45,73.34 57.15,73.34 ALU_FLASH_M0.27
  Bottom 0.152: RB0_C0.16 46.04,84.14 43.97,82.07 v43.97,72.87
RB0_8  (via drill 0.35)
  Top 0.152: v43.34,70.48 43.81,70.96 49.81,70.96 50.44,70.34 55.07,70.34 ALU_FLASH_M0.26
  Bottom 0.152: v43.34,70.48 43.34,86.44 44.77,87.87 44.77,89.85 RB0_C0.17 42.23,92.39 42.23,95.25 RB0_C1.17
RB0_9  (via drill 0.35)
  Top 0.152: R4.1 RB0_C0.18 42.23,89.85 42.23,92.71 RB0_C1.18 | v42.55,67.79 43.02,68.26 57.15,68.26 ALU_FLASH_M0.23
  Bottom 0.152: RB0_C0.18 43.5,87.15 43.02,86.68 43.02,72.71 42.55,72.23 v42.55,67.79
RB0_10  (via drill 0.35)
  Top 0.152: v42.23,73.03 39.05,73.03 38.73,73.34 24.61,73.34 v24.45,73.18
  Bottom 0.152: v24.45,73.18 25.4,74.14 ALU_FLASH_M1.6 | v42.23,73.03 42.23,89.85 RB0_C0.19 39.69,92.39 39.69,95.25 RB0_C1.19
RB0_11  (via drill 0.35)
  Top 0.152: R5.1 RB0_C0.20 39.69,89.85 39.69,92.71 RB0_C1.20 | v22.86,76.52 23.34,76.52 38.02,76.52 v38.1,76.6
  Bottom 0.152: RB0_C0.20 40.96,79.45 v38.1,76.6 | v22.86,76.52 ALU_FLASH_M1.5
RB0_12  (via drill 0.35)
  Top 0.152: v37.31,72.39 ALU_FLASH_M1.27
  Bottom 0.152: v37.31,72.39 37.31,76.68 39.69,79.06 39.69,89.85 RB0_C0.21 37.15,92.39 37.15,95.25 RB0_C1.21
RB0_13  (via drill 0.35)
  Top 0.152: R6.1 RB0_C0.22 37.15,89.85 37.15,92.71 RB0_C1.22 | v36.67,70.8 33.97,70.8 ALU_FLASH_M1.26
  Bottom 0.152: RB0_C0.22 38.42,78.42 36.67,76.68 v36.67,70.8
RB0_14
  Bottom 0.152: ALU_FLASH_M1.23 34.61,68.26 34.61,76.04 37.15,78.58 37.15,89.85 RB0_C0.23 34.61,92.39 34.61,95.25 RB0_C1.23
RB0_15  (via drill 0.35)
  Top 0.152: R7.1 RB0_C0.24 34.61,89.85 34.61,92.71 RB0_C1.24 | v34.29,56.4 34.66,56.04 71.12,56.04 v71.44,56.36
  Bottom 0.152: RB0_C0.24 35.88,77.74 34.3,76.17 34.3,56.42 v34.29,56.4 | v71.44,56.36 71.44,51.12 ALU_FLASH_M2.6
RB0_16  (via drill 0.35)
  Top 0.152: v33.34,56.36 33.96,55.73 67.69,55.73 v67.94,55.48
  Bottom 0.152: v33.34,56.36 34,57.02 34,76.29 35.08,77.38 35.08,87.47 34.61,87.95 34.61,89.85 RB0_C0.25 32.07,92.39 32.07,95.25 RB0_C1.25 | v67.94,55.48 ALU_FLASH_M2.5
RB0_17  (via drill 0.35)
  Top 0.152: R8.1 RB0_C0.26 32.07,89.85 32.07,92.71 RB0_C1.26 | v32.38,56.36 33.31,55.43 66.65,55.43 67.15,54.93 v80.64,54.93
  Bottom 0.152: RB0_C0.26 33.34,79.53 32.07,78.26 32.07,56.67 v32.38,56.36 | v80.64,54.93 79.53,53.82 79.53,48.74 ALU_FLASH_M2.27
RB0_18  (via drill 0.35)
  Top 0.152: v31.43,56.4 32.71,55.12 66.52,55.12 67.03,54.62 76.9,54.62 v77.15,54.37
  Bottom 0.152: v31.43,56.4 31.76,56.73 31.76,78.39 32.07,78.69 32.07,89.86 RB0_C0.27 29.53,92.39 29.53,95.25 RB0_C1.27 | v77.15,54.37 77.15,46.04 ALU_FLASH_M2.26
RB0_19  (via drill 0.35)
  Top 0.152: R9.1 RB0_C0.28 29.53,89.85 29.53,92.71 RB0_C1.28 | v30.48,56.4 32.06,54.82 66.4,54.82 66.9,54.32 76.42,54.32 76.92,53.81 78.66,53.81 v79.22,54.37
  Bottom 0.152: RB0_C0.28 30.8,78.58 31.46,77.92 31.46,57.38 v30.48,56.4 | v79.22,54.37 79.22,46.95 79.52,46.64 79.52,43.67 ALU_FLASH_M2.23
RB0_20  (via drill 0.35)
  Top 0.152: v29.67,56.4 31.56,54.52 46.42,54.52 v46.67,54.26
  Bottom 0.152: v29.67,56.4 29.53,56.55 29.53,79.06 29.53,89.85 RB0_C0.29 26.99,92.39 26.99,95.25 RB0_C1.29 | v46.67,54.26 46.67,51.44 ALU_FLASH_M3.6
RB0_21  (via drill 0.35)
  Top 0.152: R10.1 RB0_C0.30 26.99,89.85 26.99,92.71 RB0_C1.30 | v28.87,56.4 31.06,54.21 45.15,54.21 v45.4,53.96
  Bottom 0.152: RB0_C0.30 28.26,82.44 29.22,81.47 29.22,56.76 v28.87,56.4 | v45.4,53.96 ALU_FLASH_M3.5
RB0_22  (via drill 0.35)
  Top 0.152: v27.94,56.4 30.44,53.91 44.67,53.91 45.17,53.4 46.6,53.4 47.71,54.52 59.12,54.52 v59.37,54.26
  Bottom 0.152: v27.94,56.4 28.92,57.38 28.92,81.34 26.99,83.28 26.99,89.85 RB0_C0.31 24.45,92.39 24.45,95.25 RB0_C1.31 | v59.37,54.26 59.37,48.9 ALU_FLASH_M3.27
RB0_23  (via drill 0.35)
  Top 0.152: R11.1 RB0_C0.32 24.45,89.85 24.45,92.71 RB0_C1.32 | v29.53,45.4 30.16,46.04 54.61,46.04 ALU_FLASH_M3.26
  Bottom 0.152: RB0_C0.32 25.72,81.12 26.51,80.33 26.99,79.85 26.99,57.88 26.5,57.39 26.5,55.36 27.42,54.44 28.75,54.44 29.53,53.66 v29.53,45.4
RB0_24  (via drill 0.35)
  Top 0.152: v29.37,42.86 30,43.5 57.15,43.5 ALU_FLASH_M3.23
  Bottom 0.152: v29.37,42.86 28.97,43.26 28.97,45.63 29.22,45.88 29.22,53.53 28.62,54.13 27.3,54.13 26.19,55.24 26.19,57.51 26.68,58 26.68,79.72 24.45,81.96 24.45,89.85 RB0_C0.33 21.91,92.39 21.91,95.25 RB0_C1.33
RB0_25
  Top 0.152: R12.1 RB0_C0.34 21.91,89.85 21.91,92.71 RB0_C1.34
  Bottom 0.152: RB0_C0.34 23.18,82.8 26.38,79.6 26.38,58.13 24.29,56.04 24.29,52.07 25.4,50.96 ALU_FLASH_M4.6
RB0_26
  Bottom 0.152: ALU_FLASH_M4.5 21.59,51.44 21.59,76.52 21.91,76.83 21.91,81.27 21.91,89.85 RB0_C0.35 19.37,92.39 19.37,95.25 RB0_C1.35
RB0_27  (via drill 0.35)
  Top 0.152: R13.1 RB0_C0.36 19.37,89.85 19.37,92.71 RB0_C1.36 | v21.75,46.35 25.88,46.35 26.19,46.67 34.61,46.67 ALU_FLASH_M4.27
  Bottom 0.152: RB0_C0.36 20.64,77.2 21.29,76.55 21.29,49.53 21.75,49.07 v21.75,46.35
RB0_28  (via drill 0.35)
  Top 0.152: v21.43,44.29 21.59,44.13 32.07,44.13 ALU_FLASH_M4.26
  Bottom 0.152: v21.43,44.29 20.98,44.74 20.98,76.42 19.37,78.04 19.37,89.85 RB0_C0.37 16.83,92.39 16.83,95.25 RB0_C1.37
RB0_29  (via drill 0.35)
  Top 0.152: R14.1 RB0_C0.38 16.83,89.85 16.83,92.71 RB0_C1.38 | v21.27,41.75 21.59,41.43 31.43,41.43 34.45,41.43 ALU_FLASH_M4.23
  Bottom 0.152: RB0_C0.38 18.1,78.88 20.68,76.3 20.68,42.35 v21.27,41.75
RB0_30  (via drill 0.35)
  Top 0.152: v69.85,32.07 v20.32,32.07
  Bottom 0.152: v20.32,32.07 20.37,32.12 20.37,76.17 16.83,79.72 16.83,89.85 RB0_C0.39 14.29,92.39 14.29,95.25 RB0_C1.39 | v69.85,32.07 69.52,31.74 69.52,26.36 ALU_FLASH_LAST.6
RB0_31  (via drill 0.35)
  Top 0.152: R15.1 15.88,88.27 RB0_C0.40 14.29,89.85 14.29,92.71 RB0_C1.40 | v67.94,31.43 v19.5,31.43
  Bottom 0.152: RB0_C0.40 15.56,80.55 20.07,76.05 20.07,44.7 19.5,44.13 v19.5,31.43 | v67.94,31.43 ALU_FLASH_LAST.5
RB1_0
  Top 0.152: RB1_C0.7 5.71,87.63 8.57,87.63 RB1_C1.7
RB1_1
  Top 0.152: RB1_C0.8 8.1,85.25 11.27,85.25 RB1_C1.8
RB1_2
  Top 0.152: RB1_C1.9 8.72,84.94 5.57,84.94 RB1_C0.9
RB1_3
  Top 0.152: RB1_C0.10 8.1,82.71 11.27,82.71 RB1_C1.10
RB1_4
  Top 0.152: RB1_C1.11 8.73,82.39 5.56,82.39 RB1_C0.11
RB1_5
  Top 0.152: RB1_C0.12 8.1,80.17 11.27,80.17 RB1_C1.12
RB1_6
  Top 0.152: RB1_C1.13 8.72,79.86 5.57,79.86 RB1_C0.13
RB1_7
  Top 0.152: RB1_C0.14 8.1,77.63 11.27,77.63 RB1_C1.14
RB1_8
  Top 0.152: RB1_C1.15 8.72,77.32 5.57,77.32 RB1_C0.15
RB1_9
  Top 0.152: RB1_C0.16 8.1,75.09 11.27,75.09 RB1_C1.16
RB1_10
  Top 0.152: RB1_C1.17 8.72,74.78 5.57,74.78 RB1_C0.17
RB1_11
  Top 0.152: RB1_C0.18 8.1,72.55 11.27,72.55 RB1_C1.18
RB1_12
  Top 0.152: RB1_C1.19 8.72,72.24 5.57,72.24 RB1_C0.19
RB1_13
  Top 0.152: RB1_C0.20 8.1,70.01 11.27,70.01 RB1_C1.20
RB1_14
  Top 0.152: RB1_C1.21 9.68,68.58 8.56,69.7 5.57,69.7 RB1_C0.21
RB1_15
  Top 0.152: RB1_C0.22 8.1,67.47 11.27,67.47 RB1_C1.22
RB1_16
  Top 0.152: RB1_C1.23 8.73,67.15 5.56,67.15 RB1_C0.23
RB1_17
  Top 0.152: RB1_C0.24 8.1,64.93 11.27,64.93 RB1_C1.24
RB1_18
  Top 0.152: RB1_C1.25 8.72,64.62 5.57,64.62 RB1_C0.25
RB1_19
  Top 0.152: RB1_C0.26 8.1,62.39 11.27,62.39 RB1_C1.26
RB1_20
  Top 0.152: RB1_C1.27 8.72,62.08 5.57,62.08 RB1_C0.27
RB1_21
  Top 0.152: RB1_C0.28 8.1,59.85 11.27,59.85 RB1_C1.28
RB1_22
  Top 0.152: RB1_C1.29 8.72,59.54 5.57,59.54 RB1_C0.29
RB1_23
  Top 0.152: RB1_C0.30 8.1,57.31 11.27,57.31 RB1_C1.30
RB1_24
  Top 0.152: RB1_C1.31 8.73,56.99 5.56,56.99 RB1_C0.31
RB1_25
  Top 0.152: RB1_C0.32 8.1,54.77 11.27,54.77 RB1_C1.32
RB1_26
  Top 0.152: RB1_C1.33 8.72,54.46 5.57,54.46 RB1_C0.33
RB1_27
  Top 0.152: RB1_C0.34 8.1,52.23 11.27,52.23 RB1_C1.34
RB1_28
  Top 0.152: RB1_C1.35 8.72,51.92 5.57,51.92 RB1_C0.35
RB1_29
  Top 0.152: RB1_C0.36 8.1,49.69 11.27,49.69 RB1_C1.36
RB1_30
  Top 0.152: RB1_C1.37 8.72,49.38 5.57,49.38 RB1_C0.37
RB1_31
  Top 0.152: RB1_C0.38 8.26,46.99 11.11,46.99 RB1_C1.38
RST  (via drill 0.35)
  Top 0.152: v87.42,38.79 91.33,38.79 92.87,40.32 JP4.11
  Bottom 0.152: JP2.16 86.06,10.49 86.06,37.42 v87.42,38.79
RTB0
  Top 0.152: RTB_C1.1 88.9,95.25 91.75,95.25 RTB_C0.1
RTB1
  Top 0.152: RTB_C1.2 91.28,92.87 94.47,92.87 RTB_C0.2
RTB2
  Top 0.152: RTB_C0.3 91.9,92.55 88.74,92.55 RTB_C1.3
RTB3
  Top 0.152: RTB_C1.4 91.28,90.33 94.47,90.33 RTB_C0.4
RTB4
  Top 0.152: RTB_C0.5 91.89,90.02 88.75,90.02 RTB_C1.5
RTB5
  Top 0.152: RTB_C1.6 91.28,87.79 94.47,87.79 RTB_C0.6
RTB6
  Top 0.152: RTB_C0.7 91.89,87.48 88.75,87.48 RTB_C1.7
RTB7
  Top 0.152: RTB_C1.8 91.28,85.25 94.47,85.25 RTB_C0.8
RTB8
  Top 0.152: RTB_C0.9 91.89,84.94 88.75,84.94 RTB_C1.9
RTB9
  Top 0.152: RTB_C1.10 91.28,82.71 94.47,82.71 RTB_C0.10
RTB10
  Top 0.152: RTB_C0.11 91.89,82.4 88.75,82.4 RTB_C1.11
RTB11
  Top 0.152: RTB_C1.12 91.28,80.17 94.47,80.17 RTB_C0.12
RTB12
  Top 0.152: RTB_C0.13 91.89,79.86 88.75,79.86 RTB_C1.13
RTB13
  Top 0.152: RTB_C1.14 91.28,77.63 94.47,77.63 RTB_C0.14
RTB14
  Top 0.152: RTB_C0.15 91.89,77.32 88.75,77.32 RTB_C1.15
RTB15
  Top 0.152: RTB_C1.16 91.28,75.09 94.47,75.09 RTB_C0.16
RTB16
  Top 0.152: RTB_C0.17 91.89,74.78 88.75,74.78 RTB_C1.17
RTB17
  Top 0.152: RTB_C1.18 91.28,72.55 94.47,72.55 RTB_C0.18
RTB18
  Top 0.152: RTB_C0.19 91.89,72.24 88.75,72.24 RTB_C1.19
RTB19
  Top 0.152: RTB_C1.20 91.28,70.01 94.47,70.01 RTB_C0.20
RTB20
  Top 0.152: RTB_C0.21 91.89,69.7 88.75,69.7 RTB_C1.21
RTB21
  Top 0.152: RTB_C1.22 91.28,67.47 94.47,67.47 RTB_C0.22
RTB22
  Top 0.152: RTB_C0.23 92.88,66.03 91.75,67.16 88.75,67.16 RTB_C1.23
RTB23
  Top 0.152: RTB_C1.24 91.28,64.93 94.47,64.93 RTB_C0.24
RTB24
  Top 0.152: RTB_C0.25 91.89,64.62 88.75,64.62 RTB_C1.25
RTB25
  Top 0.152: RTB_C1.26 91.28,62.39 94.47,62.39 RTB_C0.26
RTB26
  Top 0.152: RTB_C0.27 91.89,62.08 88.75,62.08 RTB_C1.27
RTB27
  Top 0.152: RTB_C1.28 91.28,59.85 94.47,59.85 RTB_C0.28
RTB28
  Top 0.152: RTB_C0.29 91.89,59.54 88.75,59.54 RTB_C1.29
RTB29
  Top 0.152: RTB_C1.30 91.28,57.31 94.47,57.31 RTB_C0.30
RTB30
  Top 0.152: RTB_C0.31 91.89,57 88.75,57 RTB_C1.31
RTB31
  Top 0.152: RTB_C1.32 91.44,54.61 94.31,54.61 RTB_C0.32
SET_BIT  (via drill 0.35)
  Top 0.152: v94.77,11.59 77.15,11.59 v76.83,11.91 | IC4.1 92.71,28.37 93.08,28 94.83,28 v94.85,28.02
  Bottom 0.152: v94.85,28.02 94.85,11.66 v94.77,11.59 | v76.83,11.91 76.83,13.97 ALU_FLASH_LAST.19
SH_BUSY
  Bottom 0.152: JP2.17 85.25,4.45 86.68,5.87 86.68,36.83 JP3.12
SH_LOAD
  Bottom 0.152: JP2.15 83.82,5.71 83.82,7.62 86.36,10.16 86.36,36.94 88.9,39.48 88.9,41.59 JP3.10
SH_LTCH
  Bottom 0.152: JP2.13 81.28,5.71 81.28,7.62 85.75,12.09 85.75,38.44 JP3.11
SH_RTB_EN
  Bottom 0.152: JP2.12 77.79,6.99 84.31,13.51 84.31,41.29 87,43.97 91.44,43.97 92.87,45.4 JP4.7
VCC  (via drill 0.35)
  Top 0.305: ALU_FLASH_M1.31 34.23,73.72 v39.53,73.72 | v39.53,73.72 42.11,73.72 55.72,73.72 | ALU_FLASH_FIRST.31 76.9,73.72 v74.61,73.72 63.28,73.72 C14.1 63.09,73.72 55.72,73.72 | ALU_FLASH_M0.32 ALU_FLASH_M0.31 55.72,74.77 55.72,73.72 | v39.53,73.72 39.53,76.52 37.31,78.74 31.75,78.74 30.48,78.74 | ALU_FLASH_FIRST.32 ALU_FLASH_FIRST.31 | ALU_FLASH_FIRST.10 v74.61,69.85 | ALU_FLASH_M2.31 76.99,49.05 76.68,49.05 v74.38,49.05 63.34,49.05 C13.1 62.71,49.05 55.56,49.05 | 55.56,49.05 v39.45,49.05 34.13,49.05 ALU_FLASH_M4.31 31.75,48.9 17.94,48.9 15.88,46.83 15.88,43.81 ALU_Y_C1.6 | ALU_FLASH_M2.31 ALU_FLASH_M2.32 | ALU_FLASH_M3.31 55.56,49.05 | IC3.5 91.63,26.54 v91.6,26.51 91.6,26.99 91.25,27.34 89.89,27.34 89.09,26.54 IC5.5 86.64,26.54 C8.1 82.87,26.67 80.33,29.21 79.22,29.21 | v91.6,20.48 IC1.14 96.84,20.48 | ALU_FLASH_LAST.32 75.56,29.21 | 56.2,95.25 14.76,95.25 13.91,94.39 13.91,90.42 RB1_C1.6 14.29,87 14.29,83.34 15.72,81.91 C3.1 15.72,79.37 16.35,78.74 30.48,78.74 | ALU_FLASH_M1.32 30.48,78.74 | 75.56,29.21 41.75,29.21 | 41.75,29.21 v39.37,29.21 16.67,29.21 | X1.1 91.16,5.28 96.84,10.95 96.84,20.48 | IC4.5 91.63,31.78 v91.6,31.75 91.6,31.11 91.12,30.64 90.01,30.64 89.53,31.11 89.53,31.59 89.35,31.78 IC2.5 C7.1 | 79.22,29.21 75.56,29.21 | PWR1.2 C4.1 | 96.84,20.48 v96.84,21.27 96.84,22.38 97.47,23.02 C15.1 97.47,36.51 | JP4.2 JP4.4 96.52,50.48 97.47,49.53 97.47,36.67 97.47,36.51 | C12.1 41.75,29.21 | 97.47,36.51 84.93,36.51 | 84.93,36.51 83.5,36.51 80.01,36.51 79.22,35.72 | 79.22,35.72 v76.83,35.72 | 79.22,35.72 79.22,29.21 | 84.93,36.51 84.93,51.44 | 84.93,51.44 84.93,60.17 83.5,61.59 83.5,65.69 83.59,65.78 83.59,76.36
  Top 0.305: 83.59,76.36 83.59,80.87 72.55,91.92 C16.+ | ALU_FLASH_FIRST.31 79.53,76.36 83.59,76.36 | ALU_FLASH_M2.31 79.38,51.44 84.93,51.44
  Top 1.27: RB1_C0.3 RB1_C0.5 RB1_C0.6 RB1_C1.5 | RB1_C1.5 RB1_C1.3 | RB1_C1.6 RB1_C1.5 | RB0_C1.8 56.2,95.25 RB0_C1.7 RB0_C1.5 | RB0_C1.8 RB0_C0.7 | RB0_C0.7 RB0_C0.8 RB0_C0.6 58.74,86.84 59.69,85.88 64.93,85.88 70.96,91.92 C16.+ | RB0_C0.5 RB0_C0.7 | RB0_C1.6 RB0_C1.8 | PWR.4 PWR.1
  Top 1.778: ALU_Y_C1.6 ALU_Y_C1.8 16.67,33.5 16.67,29.21 v16.67,27.94 | PWR1.1 PWR1.2 PWR1.4 | PWR1.3 PWR1.1 | PWR1.1 19.21,7.94 PWR.1
  Bottom 0.305: v74.61,73.72 v74.61,69.85 74.61,67.47 74.36,67.22 74.36,61.37 74.45,61.28 74.45,56.35 C10.1 74.3,53.97 ALU_FLASH_M2.32 76.68,51.59 76.68,49.05 | ALU_FLASH_M4.31 ALU_FLASH_M4.32 30.48,54.61 C5.1 | ALU_FLASH_M3.31 ALU_FLASH_M3.32 C1.1 | v39.53,73.72 39.45,73.64 v39.45,49.05 39.45,47.39 39.78,47.05 39.78,34.07 39.37,33.66 v39.37,29.21 | v91.6,31.75 v91.6,26.51 v91.6,20.48 | 76.68,49.05 76.68,48.42 76.68,44.45 76.83,44.29 v76.83,35.72 76.83,33.81 77.47,33.18 C6.1 77.47,29.69 76.83,29.05 76.83,27.94 | JP2.2 68.42,10.64 73.03,10.64 74.3,11.91 74.3,20.32 76.83,22.86 76.83,25.4 | 76.83,25.4 76.83,27.94 | ALU_FLASH_LAST.31 76.83,25.4 | ALU_FLASH_LAST.32 76.83,27.94 | ALU_FLASH_M0.32 53.02,78.58 54.13,79.69 C11.1 | RB0_C0.8 56.2,81.76 55.4,80.96 C11.1 | C2.1 ALU_FLASH_FIRST.32 | C11.1 | C9.1 v96.84,21.27 | 76.68,49.05 v74.38,49.05
  Bottom 1.778: v16.67,27.94 PWR.3 | PWR.2 PWR.1 PWR.3 | PWR.4 PWR.3

## Text on the board
tPlace: /Users/filip/Downloads/ananas_cerny_-1.bmp
tNames: R0-R15 | ALU / SZKANDERA 2020 | +